# EAGLE design micro (EAGLE 6.5.0)
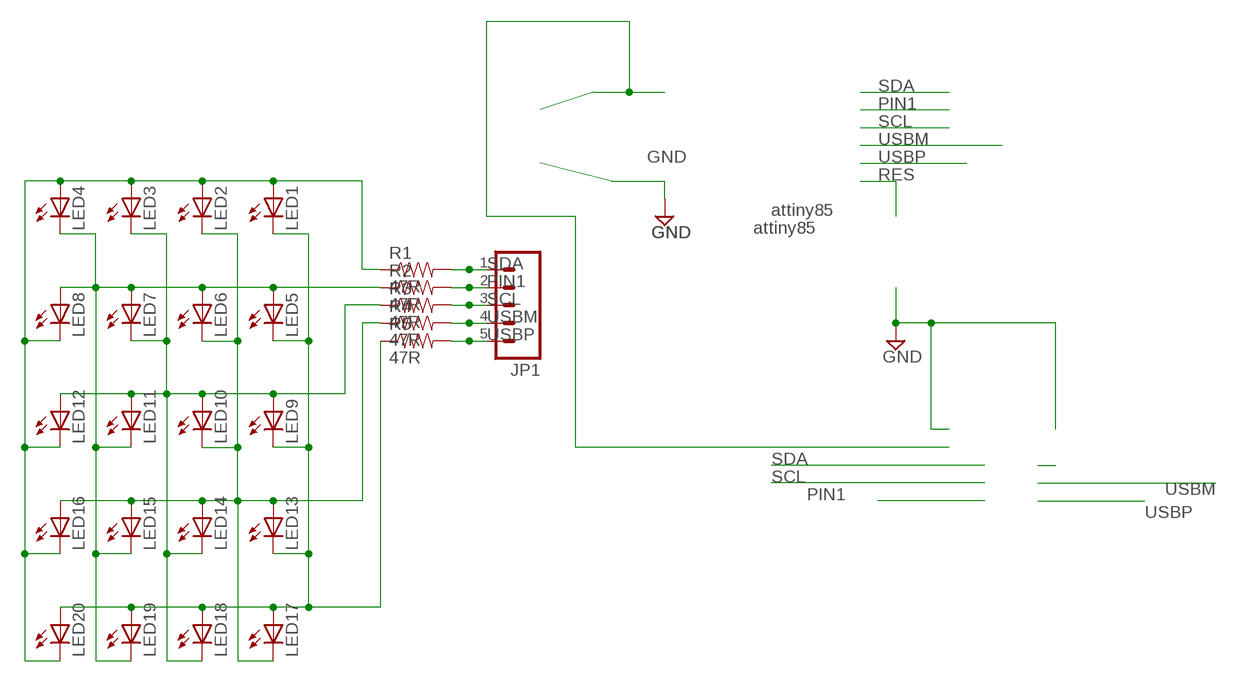
[diagram p0: schematic, sheet 1]

## Parts
JP1  M05PTH  [1X05]
LED1  LEDCHIPLED_0603  [CHIPLED_0603]
LED2  LEDCHIPLED_0603  [CHIPLED_0603]
LED3  LEDCHIPLED_0603  [CHIPLED_0603]
LED4  LEDCHIPLED_0603  [CHIPLED_0603]
LED5  LEDCHIPLED_0603  [CHIPLED_0603]
LED6  LEDCHIPLED_0603  [CHIPLED_0603]
LED7  LEDCHIPLED_0603  [CHIPLED_0603]
LED8  LEDCHIPLED_0603  [CHIPLED_0603]
LED9  LEDCHIPLED_0603  [CHIPLED_0603]
LED10  LEDCHIPLED_0603  [CHIPLED_0603]
LED11  LEDCHIPLED_0603  [CHIPLED_0603]
LED12  LEDCHIPLED_0603  [CHIPLED_0603]
LED13  LEDCHIPLED_0603  [CHIPLED_0603]
LED14  LEDCHIPLED_0603  [CHIPLED_0603]
LED15  LEDCHIPLED_0603  [CHIPLED_0603]
LED16  LEDCHIPLED_0603  [CHIPLED_0603]
LED17  LEDCHIPLED_0603  [CHIPLED_0603]
LED18  LEDCHIPLED_0603  [CHIPLED_0603]
LED19  LEDCHIPLED_0603  [CHIPLED_0603]
LED20  LEDCHIPLED_0603  [CHIPLED_0603]
R1  47R  RESISTOR0603-RES  [0603-RES]
R2  47R  RESISTOR0603-RES  [0603-RES]
R3  47R  RESISTOR0603-RES  [0603-RES]
R4  47R  RESISTOR0603-RES  [0603-RES]
R5  47R  RESISTOR0603-RES  [0603-RES]

## Nets
N$6: LED1.A LED2.A LED3.A LED4.A LED8.C LED12.C LED16.C LED20.C R1.1
N$7: LED4.C LED5.A LED6.A LED7.A LED8.A LED11.C LED15.C LED19.C R2.1
N$8: LED3.C LED7.C LED9.A LED10.A LED11.A LED12.A LED14.C LED18.C R3.1
N$9: LED2.C LED6.C LED10.C LED13.A LED14.A LED15.A LED16.A LED17.C R4.1
N$10: LED1.C LED5.C LED9.C LED13.C LED17.A LED18.A LED19.A LED20.A R5.1
PIN1: JP1.2 R2.2
SCL: JP1.3 R3.2
SDA: JP1.1 R1.2
USBM: JP1.4 R4.2
USBP: JP1.5 R5.2

## Notes on the sheet
- attiny85
- attiny85

## Library data of the parts
JP1 = SparkFun:M05: Header 5 Standard 5-pin 0.1" header. Use with straight break away headers (SKU : PRT-00116), right angle break away headers (PRT-00553), swiss pins (PRT-00743), machine pins (PRT-00117), and female headers (PRT-00115). Molex polarized connector foot print use with SKU : PRT-08230 with associated crimp pins and housings.
LED1-LED20 = led:LED: LED OSRAM: - CHIPLED LG R971, LG N971, LY N971, LG Q971, LY Q971, LO R971, LY R971 LH N974, LH R974 LS Q976, LO Q976, LY Q976 LO Q996 - Hyper CHIPLED LW Q18S LB Q993, LB Q99A, LB R99A - SideLED LS A670, LO A670, LY A670, LG A670, LP A670 LB A673, LV A673, LT A673, LW A673 LH A674 LY A675 LS A676, LA A676, LO A676, LY A676, LW A676 LS A679, LY A679, LG A679 - Hyper Micro SIDELED® LS Y876, LA Y876, LO Y876, LY Y876 LT Y87S - SmartLED LW L88C, LW L88S LB L89C, LB L89S, LG L890 LS L89K, LO L89K, LY L89K LS L896, LA L896, LO L896, LY L896 - TOPLED LS T670, LO T670, LY T670, LG T670, LP T670 LSG T670, LSP T670, LSY T670, LOP T670, LYG T670 LG T671, LOG T671, LSG T671 LB T673, LV T673, LT T673, LW T673 LH T674 LS T676, LA T676, LO T676, LY T676, LB T676, LH T676, LSB T676, LW T676 LB T67C, LV T67C, LT T67C, LS T67K, LO T67K, LY T67K, LW E67C LS E67B, LA E67B, LO E67B, LY E67B, LB E67C, LV E67C, LT E67C LW T67C LS T679, LY T679, LG T679 LS T770, LO T770, LY T770, LG T770, LP T770 LB T773, LV T773, LT T773, LW T773 LH T774 LS E675, LA E675, LY E675, LS T675 LS T776, LA T776, LO T776, LY T776, LB T776 LHGB T686 LT T68C, LB T68C - Hyper Mini TOPLED® LB M676 - Mini TOPLED Santana® LG M470 LS M47K, LO M47K, LY M47K Source: http://www.osram.convergy.de LUXEON: - LUMILED® LXK2-PW12-R00, LXK2-PW12-S00, LXK2-PW14-U00, LXK2-PW14-V00 LXK2-PM12-R00, LXK2-PM12-S00, LXK2-PM14-U00 LXK2-PE12-Q00, LXK2-PE12-R00, LXK2-PE12-S00, LXK2-PE14-T00, LXK2-PE14-U00 LXK2-PB12-K00, LXK2-PB12-L00, LXK2-PB12-M00, LXK2-PB14-N00, LXK2-PB14-P00, LXK2-PB14-Q00 LXK2-PR12-L00, LXK2-PR12-M00, LXK2-PR14-Q00, LXK2-PR14-R00 LXK2-PD12-Q00, LXK2-PD12-R00, LXK2-PD12-S00 LXK2-PH12-R00, LXK2-PH12-S00 LXK2-PL12-P00, LXK2-PL12-Q00, LXK2-PL12-R00 Source: www.luxeon.com KINGBRIGHT: KA-3528ASYC Source: www.kingbright.com
R1-R5 = SparkFun:RESISTOR: Resistor Basic schematic elements and footprints for 0603, 1206, and PTH resistors.

## Net classes
0 default: width 0.203 mm, drill 0.356 mm, clearance 0.203 mm
2 pwr: width 0.203 mm, drill 0.356 mm, clearance 0.203 mm

## Board
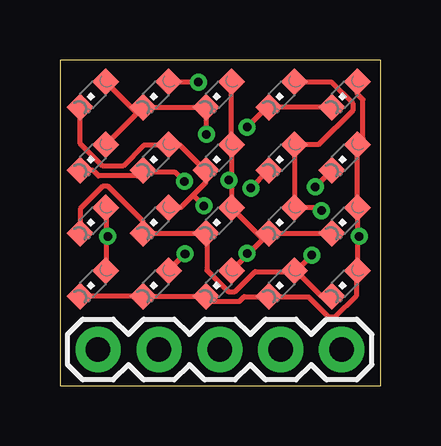
[diagram p1: board, top side]
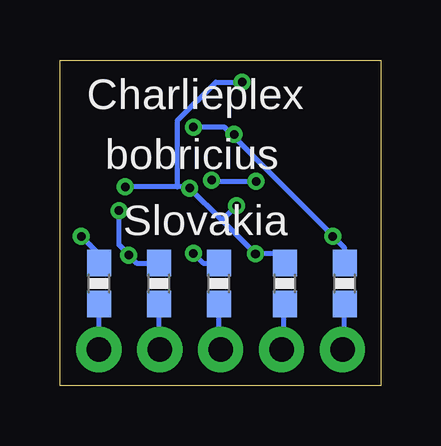
[diagram p2: board, bottom side, seen from below]

Size 13.38 x 13.56 mm. Coordinates in mm from the lower left corner, seen from the top.
Outline: 0,13.56 0,0 13.38,0 13.38,13.56 0,13.56
Copper layers (1*16): Top 0.0356mm / dielectric 1.5011mm / Bottom 0.0356mm
Design rules "default *": minimum track width 8mil, minimum drill 13mil, track to track 8mil, track to pad 8mil, pad to pad 8mil, via to via 8mil, smd to smd 8mil, copper to edge 15mil, drill to drill 12mil, minimum pad ring 7mil, minimum via ring 7mil, stop-mask expansion 4mil, vias tented up to drill 30mil, thermal gap 10mil

### Footprints (pad centres in the part's own frame; a part is rotated, then mirrored left to right if it is on the bottom)
1X05 = drill 1.016 pad 1.88: 1 0,0; 2 2.54,0; 3 5.08,0; 4 7.62,0; 5 10.16,0
CHIPLED_0603 = smd 0.8 x 0.8: A 0,-0.75; C 0,0.75
0603-RES = smd 1.1 x 1: 1 -0.85,0; 2 0.85,0

### Placement (x,y rotation side)
JP1  11.75,1.5 180 top
LED1  11.88,12.12 135 top
LED2  11.88,9.5 135 top
LED3  11.88,6.88 135 top
LED4  11.88,4.25 135 top
LED5  9.25,12.12 135 top
LED6  9.25,9.5 135 top
LED7  9.25,6.88 135 top
LED8  9.25,4.25 135 top
LED9  6.62,12.12 135 top
LED10  6.62,9.5 135 top
LED11  6.62,6.88 135 top
LED12  6.62,4.25 135 top
LED13  4,12.12 135 top
LED14  4,9.5 135 top
LED15  4,6.88 135 top
LED16  4,4.25 135 top
LED17  1.38,12.12 135 top
LED18  1.38,9.5 135 top
LED19  1.38,6.88 135 top
LED20  1.38,4.25 135 top
R1  11.75,4.25 270 bottom
R2  9.25,4.25 270 bottom
R3  6.75,4.25 270 bottom
R4  4,4.25 270 bottom
R5  1.5,4.25 270 bottom

### Tracks (layer width: path | path; a pad name or v marks a point on that pad's centre or on a via)
N$6  (via drill 0.36)
  Top 0.203: LED20.C LED16.C 3.57,3.73 LED12.C 6.18,3.68 6.36,3.5 7.48,3.5 7.68,3.7 8.7,3.7 LED8.C 8.8,3.68 10.38,3.68 11.21,2.84 11.47,2.84 12.36,3.73 12.36,4.69 LED4.A 12.41,4.8 12.41,6.22 | 12.41,6.22 12.41,7.39 LED3.A 12.41,7.49 LED2.A 12.46,10.1 12.64,10.28 12.64,11.91 12.41,12.14 12.41,12.64 LED1.A | v12.48,6.22 12.41,6.22
  Bottom 0.203: v12.48,6.22 11.77,5.51 11.77,5.1 R1.1
N$7  (via drill 0.36)
  Top 0.203: LED5.A 9.79,12.64 11.32,12.64 12.23,11.73 12.23,11.48 10.81,10.05 9.89,10.05 LED6.A 9.79,10.03 9.79,7.41 LED7.A 9.89,7.41 10.78,7.41 v10.91,7.29 | LED4.C 10.91,3.73 9.87,4.77 9.79,4.77 LED8.A | v10.5,5.43 9.92,4.85 LED8.A | LED19.C 0.85,7.36 1.79,8.3 2.02,8.3 3.47,6.85 LED15.C 3.57,6.34 LED11.C 6.13,6.24 6.13,4.8 7.02,3.91 7.3,3.91 8.14,4.75 9.69,4.75 LED8.A
  Bottom 0.203: R2.1 10.17,5.1 v10.5,5.43 10.55,5.51 10.91,5.86 v10.91,7.29
N$8  (via drill 0.36)
  Top 0.203: LED18.C 1.38,8.96 1.61,8.73 3.24,8.73 LED14.C 3.54,8.88 4.81,8.88 v5.19,8.5 | 7.85,5.47 8.7,6.32 LED7.C | 7.85,5.47 7.18,4.8 LED12.A | LED3.C 8.8,6.34 LED7.C | LED7.C 8.42,6.14 7.18,7.39 LED11.A 7.18,7.49 7.18,8.55 | 7.18,8.55 7.18,10.03 LED10.A 7.15,10.13 7.15,12.64 LED9.A | v7.81,5.51 7.85,5.47 | v7.05,8.55 7.18,8.55
  Bottom 0.203: v7.81,5.51 7.4,5.1 6.77,5.1 R3.1 | v5.19,8.5 7,8.5 v7.05,8.55
N$9  (via drill 0.36)
  Top 0.203: 5.56,7.93 6.08,8.45 LED10.C 6.01,9.01 4.99,10.03 LED14.A 4.43,10 3.49,10 2.63,9.14 1.79,9.14 0.85,10.08 0.85,11.58 LED17.C | 5.56,7.93 5.04,7.41 LED15.A | v5.22,5.48 4.53,4.8 LED16.A | v7.96,8.23 8.7,8.96 LED6.C | v10.65,8.27 LED2.C | v5.78,12.64 4.53,12.64 LED13.A | v6.01,7.49 5.56,7.93
  Bottom 0.203: R4.1 4.03,5.1 4.41,5.48 v5.22,5.48 6.62,6.88 | 6.62,6.88 v7.96,8.23 8.04,8.27 8.47,8.27 | 8.47,8.27 v10.65,8.27 | v5.78,12.64 6.87,12.64 8.47,11.04 8.47,8.27 | 6.62,6.88 v6.01,7.49
N$10  (via drill 0.36)
  Top 0.203: LED18.A 1.92,10.05 3.47,11.6 LED13.C | LED13.C 3.57,11.6 6.08,11.6 LED9.C 6.11,11.5 v6.11,10.46 | LED17.A 1.92,12.64 3.16,11.4 LED13.C | LED1.C 11.34,11.6 8.72,11.6 LED5.C 8.62,11.58 v7.81,10.77 | 1.92,6.22 1.92,7.39 LED19.A | 1.92,6.22 1.92,4.8 LED20.A | v1.99,6.22 1.92,6.22
  Bottom 0.203: R5.1 1.51,5.73 v1.99,6.22 2.04,6.29 6.16,10.41 | v7.81,10.77 6.51,10.77 6.16,10.41 | v6.11,10.46 6.16,10.41
PIN1
  Bottom 0.203: R2.2 9.23,3.4 9.23,1.27 JP1.2
SCL
  Bottom 0.203: R3.2 6.74,1.32 6.69,1.27 JP1.3
SDA
  Bottom 0.203: R1.2 11.75,1.27 JP1.1
USBM
  Bottom 0.203: R4.2 4.03,3.4 4.03,1.37 4.13,1.27 JP1.4
USBP
  Bottom 0.203: R5.2 1.51,1.34 1.59,1.27 JP1.5

### Text on the board
bNames: Charlieplex | bobricius | Slovakia